# Altium schematic sheet Driver.SchDoc
size A1
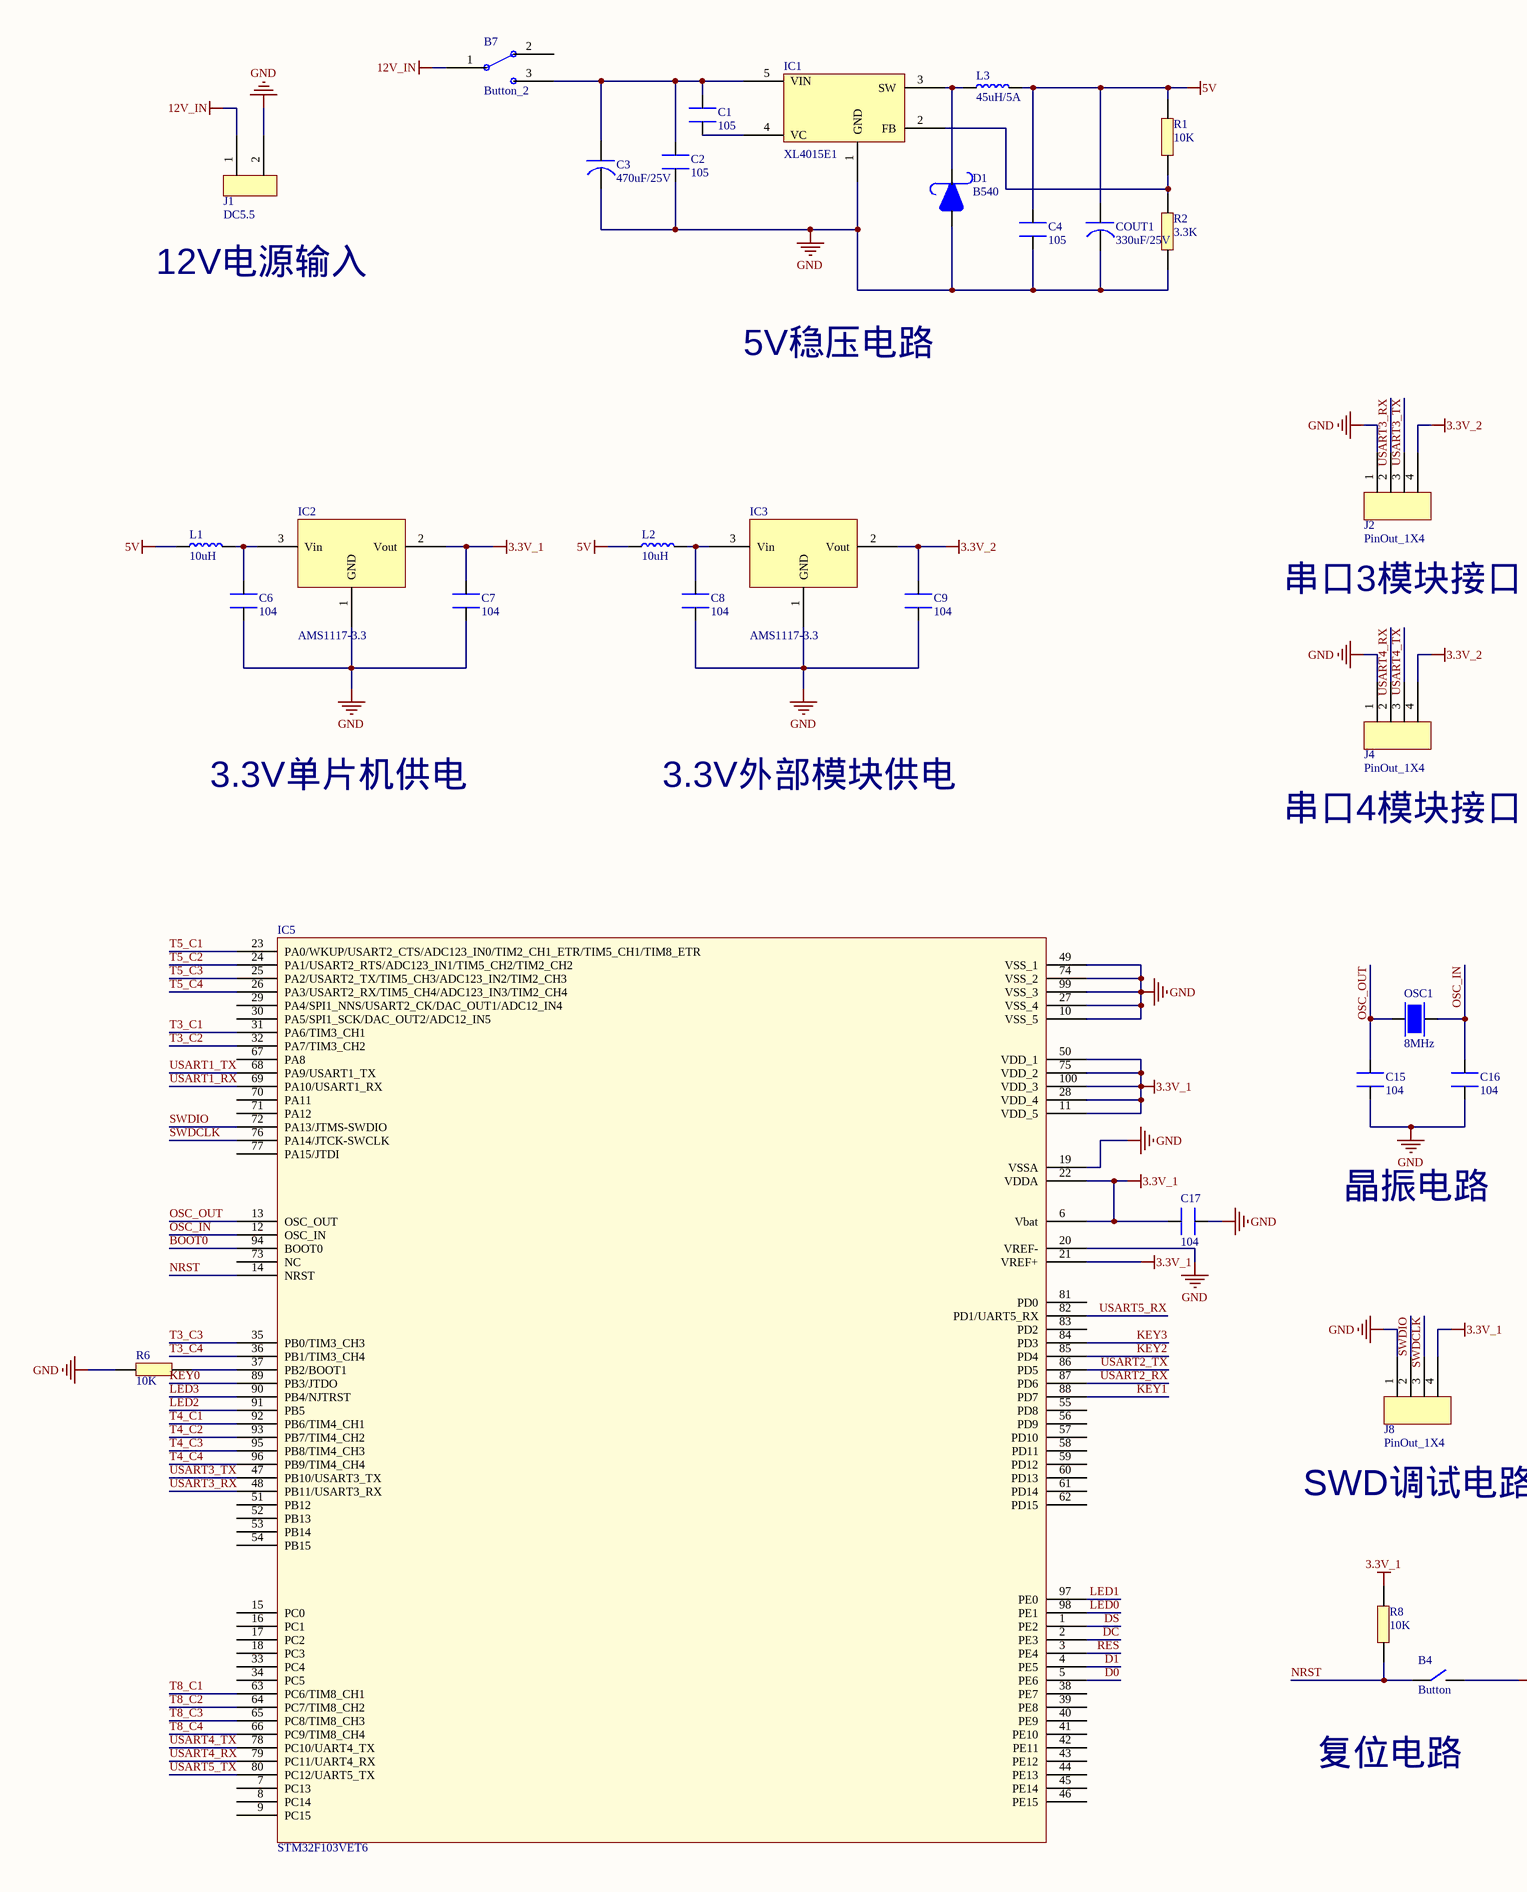
[diagram p0: Driver.SchDoc, left]
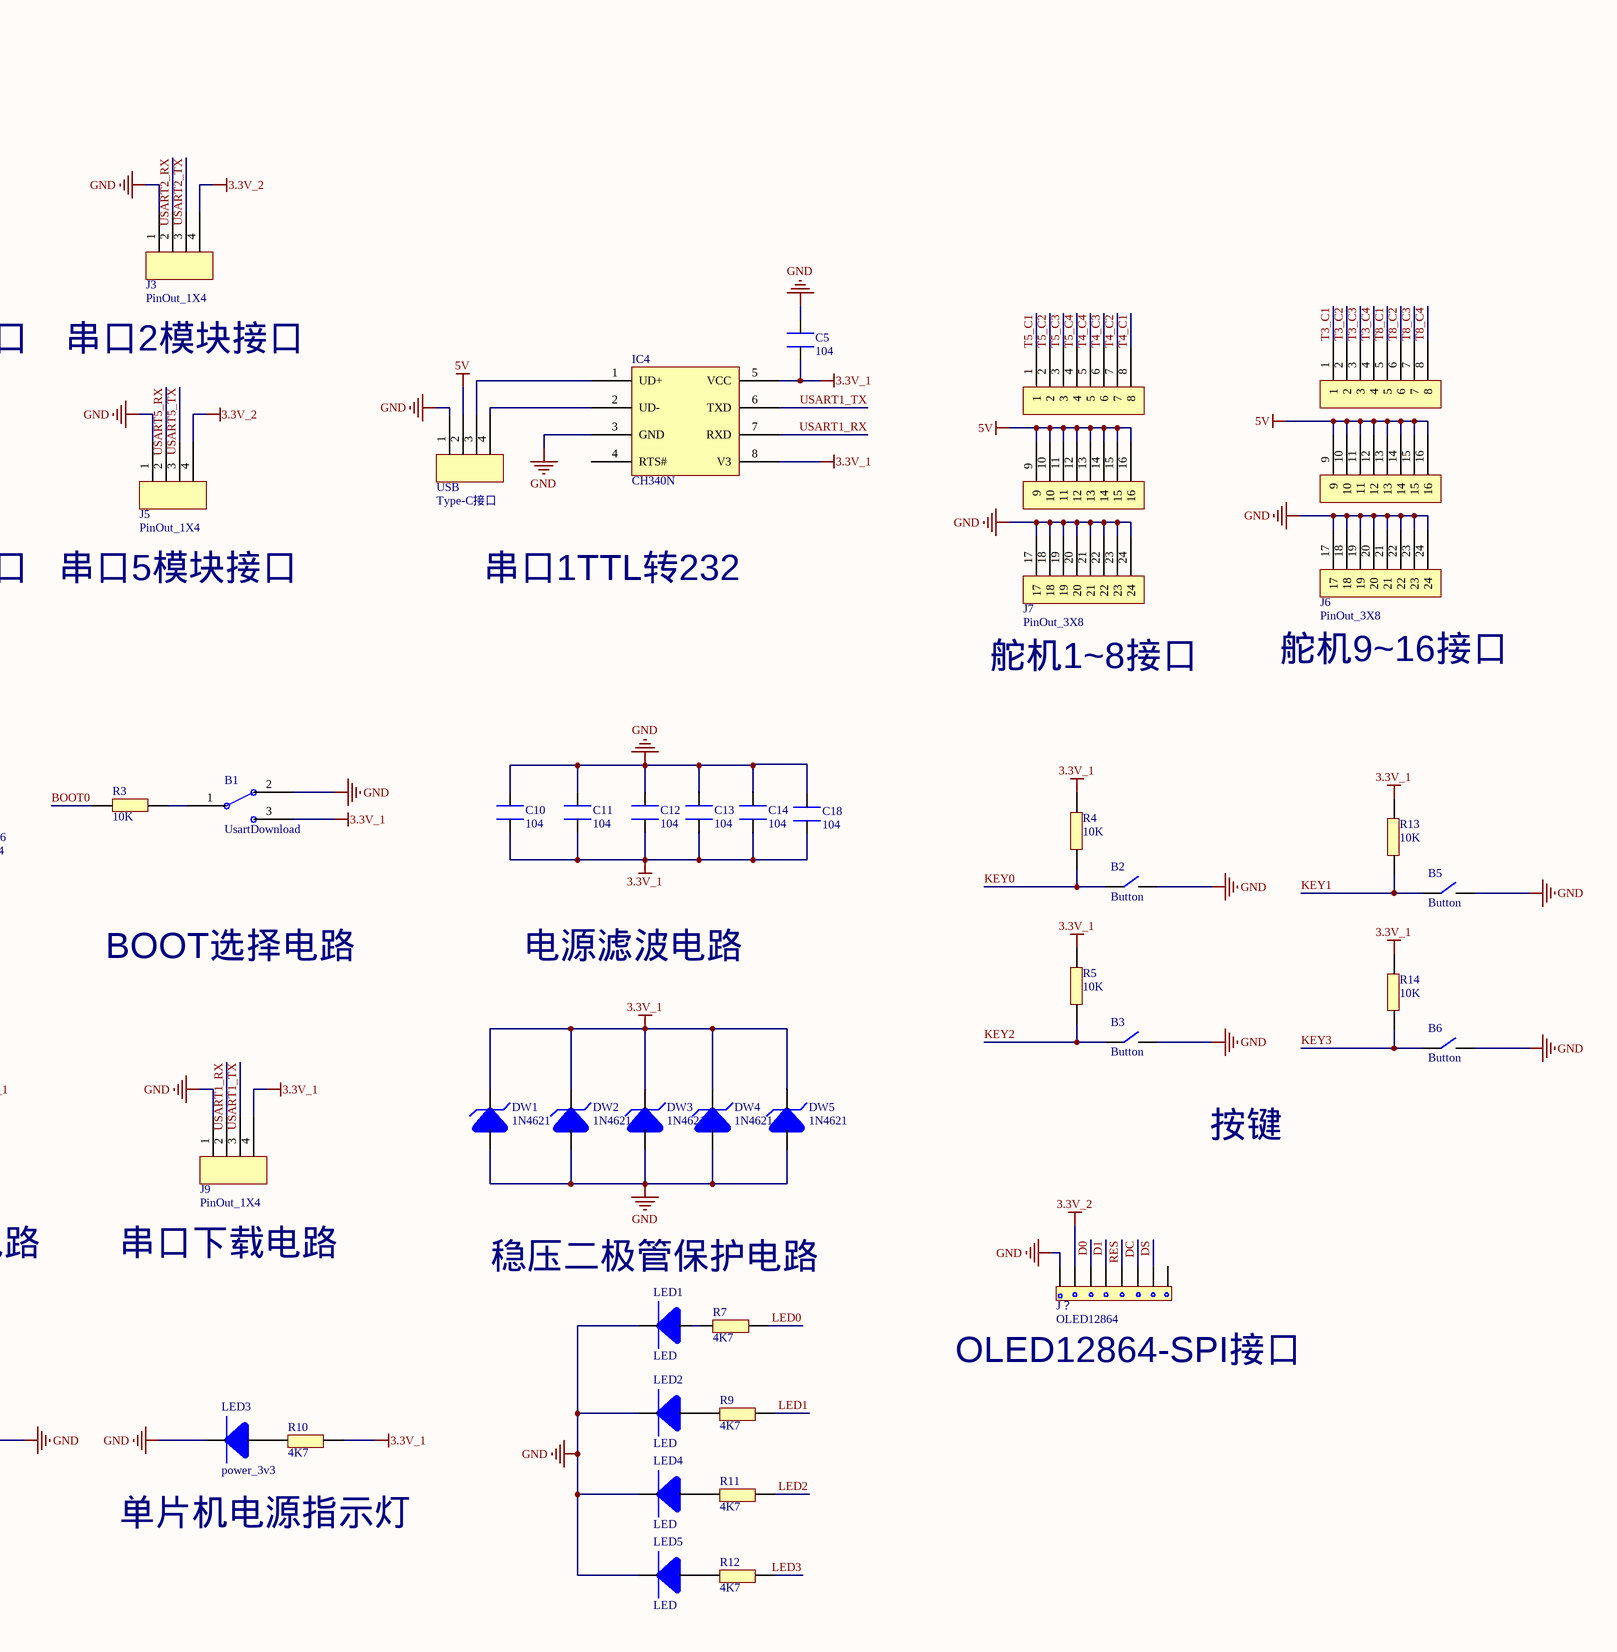
[diagram p1: Driver.SchDoc, right]

## Parts
B1  UsartDownload  [BUTTON_7X7]
B2  Button  [BUTTON]
B3  Button  [BUTTON]
B4  Button  [BUTTON]
B5  Button  [BUTTON]
B6  Button  [BUTTON]
B7  Button_2  [BUTTON_7X7]
C1  105  [0805]
C2  105  [0805]
C3  470uF/25V  [CM D(6.3X7.7)]
C4  105  [0805]
C5  104  [0805]
C6  104  [0805]
C7  104  [0805]
C8  104  [0805]
C9  104  [0805]
C10  104  [0805]
C11  104  [0805]
C12  104  [0805]
C13  104  [0805]
C14  104  [0805]
C15  104  [0805]
C16  104  [0805]
C17  104  [0805]
C18  104  [0805]
COUT1  330uF/25V  [CM D(6.3X7.7)]
D1  B540  [SMA/DO-214AC]
DW1  1N4621  [1206]
DW2  1N4621  [1206]
DW3  1N4621  [1206]
DW4  1N4621  [1206]
DW5  1N4621  [1206]
IC1  XL4015E1  [TO236-5]
IC2  AMS1117-3.3  [AMS1117]
IC3  AMS1117-3.3  [AMS1117]
IC4  CH340N  [SOP-8]
IC5  STM32F103VET6  [LQFP100-14X14]
J1  DC5.5  [DC_5.5]
J2  PinOut_1X4  [MX1.25]
J3  PinOut_1X4  [MX1.25]
J4  PinOut_1X4  [MX1.25]
J5  PinOut_1X4  [MX1.25]
J6  PinOut_3X8  [HEAD_3X8]
J7  PinOut_3X8  [HEAD_3X8]
J8  PinOut_1X4  [MX1.25]
J9  PinOut_1X4  [MX1.25]
J？  OLED12864  [HEAD_1X8]
L1  10uH  [0630]
L2  10uH  [0630]
L3  45uH/5A  [0630]
LED1  LED  [1206]
LED2  LED  [1206]
LED3  power_3v3  [1206]
LED4  LED  [1206]
LED5  LED  [1206]
OSC1  8MHz  [OSC]
R1  10K  [0805]
R2  3.3K  [0805]
R3  10K  [0805]
R4  10K  [0805]
R5  10K  [0805]
R6  10K  [0805]
R7  4K7  [0805]
R8  10K  [0805]
R9  4K7  [0805]
R10  4K7  [0805]
R11  4K7  [0805]
R12  4K7  [0805]
R13  10K  [0805]
R14  10K  [0805]
USB  Type-C接口  [Type-C]

## Nets
3.3V_1: B1.3 C5.1 C7.1 C10.1 C11.1 C12.1 C13.1 C14.1 C17.1 C18.1 DW1.1(-) DW2.1(-) DW3.1(-) DW4.1(-) DW5.1(-) IC2.2(Vout) IC4.5(VCC) IC4.8(V3) IC5.6(Vbat) IC5.11(VDD_5) IC5.21(VREF+) IC5.22(VDDA) IC5.28(VDD_4) IC5.50(VDD_1) IC5.75(VDD_2) IC5.100(VDD_3) J8.4 J9.4 R4.2 R5.2 R8.2 R10.1 R13.2 R14.2
3.3V_2: C9.1 IC3.2(Vout) J2.4 J3.4 J4.4 J5.4 J？.2
5V: C4.2 COUT1.2 J6.9 J6.10 J6.11 J6.12 J6.13 J6.14 J6.15 J6.16 J7.9 J7.10 J7.11 J7.12 J7.13 J7.14 J7.15 J7.16 L1.1 L2.1 L3.2 R1.2 USB.2
12V_IN: B7.1 J1.1
GND: B1.2 B2.2 B3.2 B4.2 B5.2 B6.2 C2.1 C3.1 C4.1 C5.2 C6.2 C7.2 C8.2 C9.2 C10.2 C11.2 C12.2 C13.2 C14.2 C15.1 C16.1 C17.2 C18.2 COUT1.1 D1.2 DW1.2(+) DW2.2(+) DW3.2(+) DW4.2(+) DW5.2(+) IC1.1(GND) IC2.1(GND) IC3.1(GND) IC4.3(GND) IC5.10(VSS_5) IC5.19(VSSA) IC5.20(VREF-) IC5.27(VSS_4) IC5.49(VSS_1) IC5.74(VSS_2) IC5.99(VSS_3) J1.2 J2.1 J3.1 J4.1 J5.1 J6.17 J6.18 J6.19 J6.20 J6.21 J6.22 J6.23 J6.24 J7.17 J7.18 J7.19 J7.20 J7.21 J7.22 J7.23 J7.24 J8.1 J9.1 J？.1 LED1.1(-) LED2.1(-) LED3.1(-) LED4.1(-) LED5.1(-) R2.1 R6.1 USB.1
BOOT0: IC5.94(BOOT0) R3.1
D0: IC5.5(PE6) J？.3
D1: IC5.4(PE5) J？.4
DC: IC5.2(PE3) J？.6
DS: IC5.1(PE2) J？.7
KEY0: B2.1 IC5.89(PB3/JTDO) R4.1
KEY1: B5.1 IC5.88(PD7) R13.1
KEY2: B3.1 IC5.85(PD4) R5.1
KEY3: B6.1 IC5.84(PD3) R14.1
LED0: IC5.98(PE1) R7.1
LED1: IC5.97(PE0) R9.1
LED2: IC5.91(PB5) R11.1
LED3: IC5.90(PB4/NJTRST) R12.1
NRST: B4.1 IC5.14(NRST) R8.1
OSC_IN: C16.2 IC5.12(OSC_IN) OSC1.2
OSC_OUT: C15.2 IC5.13(OSC_OUT) OSC1.1
RES: IC5.3(PE4) J？.5
SWDCLK: IC5.76(PA14/JTCK-SWCLK) J8.3
SWDIO: IC5.72(PA13/JTMS-SWDIO) J8.2
T3_C1: IC5.31(PA6/TIM3_CH1) J6.1
T3_C2: IC5.32(PA7/TIM3_CH2) J6.2
T3_C3: IC5.35(PB0/TIM3_CH3) J6.3
T3_C4: IC5.36(PB1/TIM3_CH4) J6.4
T4_C1: IC5.92(PB6/TIM4_CH1) J7.8
T4_C2: IC5.93(PB7/TIM4_CH2) J7.7
T4_C3: IC5.95(PB8/TIM4_CH3) J7.6
T4_C4: IC5.96(PB9/TIM4_CH4) J7.5
T5_C1: IC5.23(PA0/WKUP/USART2_CTS/ADC123_IN0/TIM2_CH1_ETR/TIM5_CH1/TIM8_ETR) J7.1
T5_C2: IC5.24(PA1/USART2_RTS/ADC123_IN1/TIM5_CH2/TIM2_CH2) J7.2
T5_C3: IC5.25(PA2/USART2_TX/TIM5_CH3/ADC123_IN2/TIM2_CH3) J7.3
T5_C4: IC5.26(PA3/USART2_RX/TIM5_CH4/ADC123_IN3/TIM2_CH4) J7.4
T8_C1: IC5.63(PC6/TIM8_CH1) J6.5
T8_C2: IC5.64(PC7/TIM8_CH2) J6.6
T8_C3: IC5.65(PC8/TIM8_CH3) J6.7
T8_C4: IC5.66(PC9/TIM8_CH4) J6.8
USART1_RX: IC4.7(RXD) IC5.69(PA10/USART1_RX) J9.2
USART1_TX: IC4.6(TXD) IC5.68(PA9/USART1_TX) J9.3
USART2_RX: IC5.87(PD6) J3.2
USART2_TX: IC5.86(PD5) J3.3
USART3_RX: IC5.48(PB11/USART3_RX) J2.2
USART3_TX: IC5.47(PB10/USART3_TX) J2.3
USART4_RX: IC5.79(PC11/UART4_RX) J4.2
USART4_TX: IC5.78(PC10/UART4_TX) J4.3
USART5_RX: IC5.82(PD1/UART5_RX) J5.2
USART5_TX: IC5.80(PC12/UART5_TX) J5.3
NetB1_1: B1.1 R3.2
NetB7_3: B7.3 C1.2 C2.2 C3.2 IC1.5(VIN)
NetC1_1: C1.1 IC1.4(VC)
NetC6_1: C6.1 IC2.3(Vin) L1.2
NetC8_1: C8.1 IC3.3(Vin) L2.2
NetD1_1: D1.1 IC1.3(SW) L3.1
NetIC1_2: IC1.2(FB) R1.1 R2.2
NetIC4_1: IC4.1(UD+) USB.3
NetIC4_2: IC4.2(UD-) USB.4
NetIC5_37: IC5.37(PB2/BOOT1) R6.2
NetLED1_2: LED1.2(+) R7.2
NetLED2_2: LED2.2(+) R9.2
NetLED3_2: LED3.2(+) R10.2
NetLED4_2: LED4.2(+) R11.2
NetLED5_2: LED5.2(+) R12.2

Not connected (* = marked no-connect by the designer): B7 2; IC4 4(RTS#); IC5 7(PC13) 8(PC14) 9(PC15) 15(PC0) 16(PC1) 17(PC2) 18(PC3) 29(PA4/SPI1_NNS/USART2_CK/DAC_OUT1/ADC12_IN4) 30(PA5/SPI1_SCK/DAC_OUT2/ADC12_IN5) 33(PC4) 34(PC5) 38(PE7) 39(PE8) 40(PE9) 41(PE10) 42(PE11) 43(PE12) 44(PE13) 45(PE14) 46(PE15) 51(PB12) 52(PB13) 53(PB14) 54(PB15) 55(PD8) 56(PD9) 57(PD10) 58(PD11) 59(PD12) 60(PD13) 61(PD14) 62(PD15) 67(PA8) 70(PA11) 71(PA12) 73(NC) 77(PA15/JTDI) 81(PD0) 83(PD2); J？ 8

## Notes on the sheet
- 12V电源输入
- 5V稳压电路
- 串口3模块接口
- 串口2模块接口
- 3.3V单片机供电
- 3.3V外部模块供电
- 串口4模块接口
- 串口5模块接口
- 串口1TTL转232
- 舵机1~8接口
- 舵机9~16接口
- 晶振电路
- BOOT选择电路
- 电源滤波电路
- 按键
- SWD调试电路
- 串口下载电路
- (near LED1) 稳压二极管保护电路
- (near J？) OLED12864-SPI接口
- 复位电路
- 单片机电源指示灯

## Library data of the parts
B1 B7 = Button_2: pin to pad: 1>2 2>1
C1 C2 C4-C18 = CAP
C3 COUT1 = TAN
D1 = SBD
DW1-DW5 = DW
J1 = PinOut_1X2
J？ = PinOut_1X8
L1-L3 = IND
LED3 = LED
OSC1 = OSC
R1-R14 = RES
USB = PinOut_1X4: pin to pad: 1>A12 2>A9 3>A6 4>A7